# Altium project tclab_v1i1.PrjPcb (part 3 of 4)

## Sheet A4_esp32.SchDoc
size 368 x 228 mm; SheetNumber: 4; SheetTotal: 6
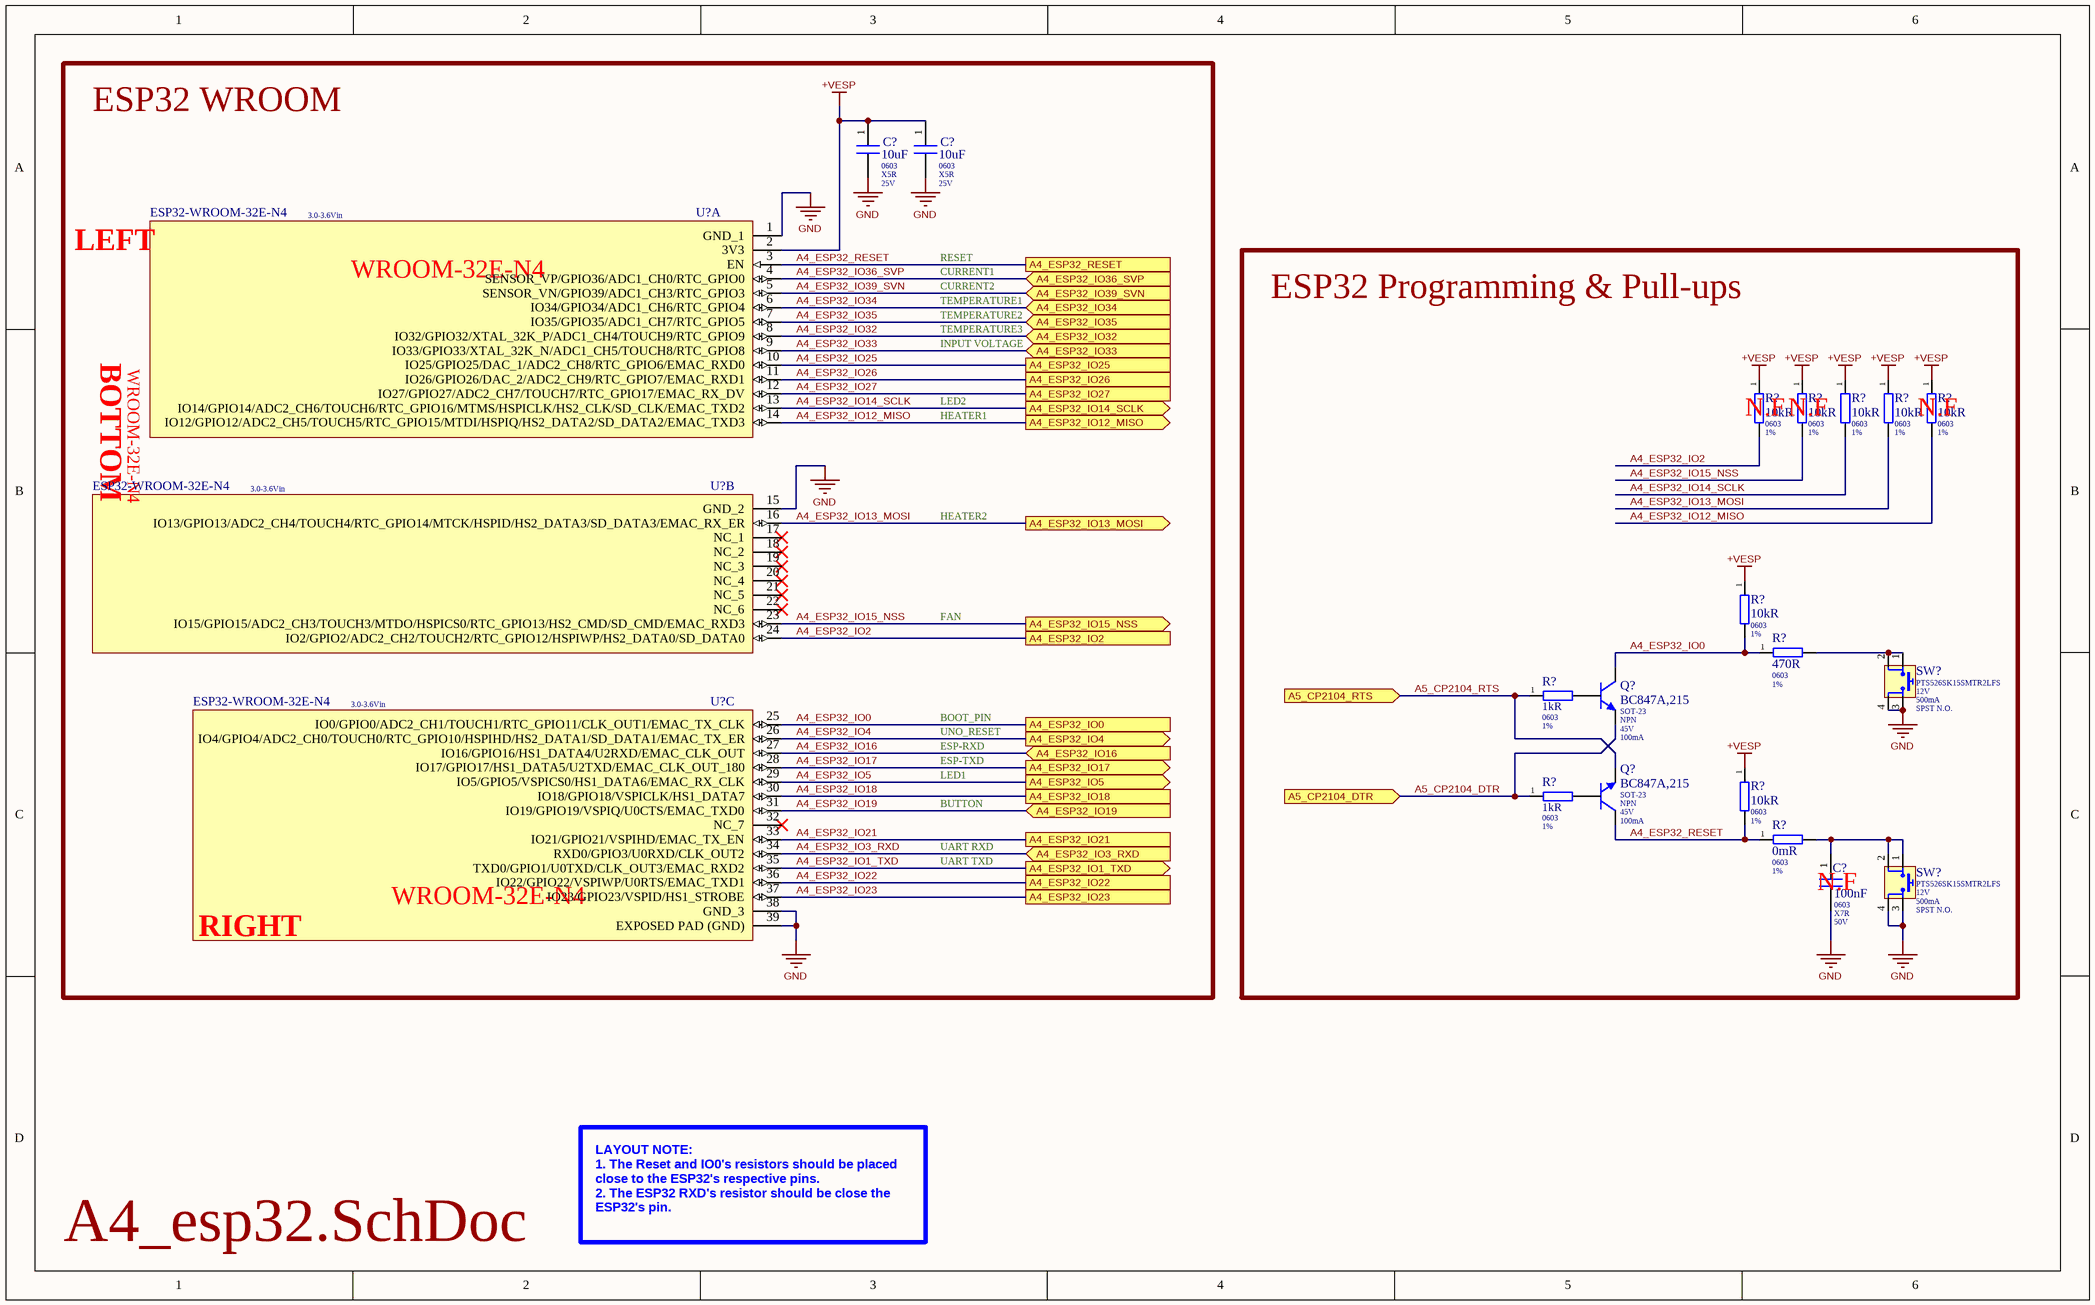
[diagram p3: A4_esp32.SchDoc]

### Parts
(Parts that share a designator on the sheet are numbered #1, #2 ... from top to bottom, then left to right.)
C?#13  Capacitance: 10uF  Case Code (Imperial): 0603  Dielectric: X5R  Voltage: 25V  [CAPC1608X10N]  (hidden comment: CAP-CER_10u_25V_20%_X5R_0603)
C?#14  Capacitance: 10uF  Case Code (Imperial): 0603  Dielectric: X5R  Voltage: 25V  [CAPC1608X10N]  (hidden comment: CAP-CER_10u_25V_20%_X5R_0603)
C?#15  Capacitance: 100nF  Case/Package: 0603  Dielectric: X7R  Voltage Rating (DC): 50V  [CAPC1608X09N]  (hidden comment: CAP-CER_100n_50V_20%_X7R_0603)
Q?#5  MFG PN: BC847A,215  Case/Package: SOT-23  Polarity: NPN  Voltage Rating (DC): 45V  Max Collector Current: 100mA  [SOT95P230X110-3N]  (hidden comment: TRNS-NPN_45V_100mA_SOT-23)
Q?#6  MFG PN: BC847A,215  Case/Package: SOT-23  Polarity: NPN  Voltage Rating (DC): 45V  Max Collector Current: 100mA  [SOT95P230X110-3N]  (hidden comment: TRNS-NPN_45V_100mA_SOT-23)
R?#33  Resistance: 10kR  Case/Package: 0603  Tolerance: 1%  [RESC1608X06N]  (hidden comment: RES_10K_100mW_1%_0603)
R?#34  Resistance: 10kR  Case/Package: 0603  Tolerance: 1%  [RESC1608X06N]  (hidden comment: RES_10K_100mW_1%_0603)
R?#35  Resistance: 10kR  Case/Package: 0603  Tolerance: 1%  [RESC1608X06N]  (hidden comment: RES_10K_100mW_1%_0603)
R?#36  Resistance: 10kR  Case/Package: 0603  Tolerance: 1%  [RESC1608X06N]  (hidden comment: RES_10K_100mW_1%_0603)
R?#37  Resistance: 10kR  Case/Package: 0603  Tolerance: 1%  [RESC1608X06N]  (hidden comment: RES_10K_100mW_1%_0603)
R?#38  Resistance: 10kR  Case/Package: 0603  Tolerance: 1%  [RESC1608X06N]  (hidden comment: RES_10K_100mW_1%_0603)
R?#39  value 470R  Case/Package: 0603  Tolerance: 1%  [RESC1608X06N]  (hidden comment: RES_470R_100mW_1%_0603)
R?#40  Resistance: 1kR  Case/Package: 0603  Tolerance: 1%  [RESC1608X06N]  (hidden comment: RES_1K_100mW_1%_0603)
R?#41  Resistance: 10kR  Case/Package: 0603  Tolerance: 1%  [RESC1608X06N]  (hidden comment: RES_10K_100mW_1%_0603)
R?#42  Resistance: 1kR  Case/Package: 0603  Tolerance: 1%  [RESC1608X06N]  (hidden comment: RES_1K_100mW_1%_0603)
R?#43  Resistance: 0mR  Case/Package: 0603  Tolerance: 1%  [RESC1608X06N]  (hidden comment: RES_0R_100mW_1%_0603)
SW?#2  MFG PN: PTS526SK15SMTR2LFS  _Maximum Voltage: 12V  _Maximum Current: 500mA  _Function: SPST N.O.  [CK_PTS526SK15SMTR2LFS]  (hidden comment: SW_Tactile_1_SPST-N.O._12_500m_SMD)
SW?#3  MFG PN: PTS526SK15SMTR2LFS  _Maximum Voltage: 12V  _Maximum Current: 500mA  _Function: SPST N.O.  [CK_PTS526SK15SMTR2LFS]  (hidden comment: SW_Tactile_1_SPST-N.O._12_500m_SMD)
U?#8  MFG PN: ESP32-WROOM-32E-N4  Supply Voltage: 3.0-3.6Vin  [XCVR_ESP32-WROOM-32E]  (hidden comment: MOD_XCVR_3-3.6Vin_18x25.5x3.1mm)  (part A of 3)
U?#9  MFG PN: ESP32-WROOM-32E-N4  Supply Voltage: 3.0-3.6Vin  [XCVR_ESP32-WROOM-32E]  (hidden comment: MOD_XCVR_3-3.6Vin_18x25.5x3.1mm)  (part B of 3)
U?#10  MFG PN: ESP32-WROOM-32E-N4  Supply Voltage: 3.0-3.6Vin  [XCVR_ESP32-WROOM-32E]  (hidden comment: MOD_XCVR_3-3.6Vin_18x25.5x3.1mm)  (part C of 3)

### Blocks framed on the sheet
ESP32 WROOM: C?#13 C?#14 U?#8-U?#10
ESP32 Programming & Pull-ups: C?#15 Q?#5 Q?#6 R?#33-R?#43 SW?#2 SW?#3

### Ports
A4_ESP32_IO0, A4_ESP32_IO1_TXD (out), A4_ESP32_IO2, A4_ESP32_IO3_RXD (in), A4_ESP32_IO4 (out), A4_ESP32_IO5 (out), A4_ESP32_IO12_MISO (out), A4_ESP32_IO13_MOSI (out), A4_ESP32_IO14_SCLK (out), A4_ESP32_IO15_NSS (out), A4_ESP32_IO16 (in), A4_ESP32_IO17 (out), A4_ESP32_IO18, A4_ESP32_IO19 (in), A4_ESP32_IO21, A4_ESP32_IO22, A4_ESP32_IO23, A4_ESP32_IO25, A4_ESP32_IO26, A4_ESP32_IO27, A4_ESP32_IO32 (in), A4_ESP32_IO33 (in), A4_ESP32_IO34 (in), A4_ESP32_IO35 (in), A4_ESP32_IO36_SVP (in), A4_ESP32_IO39_SVN (in), A4_ESP32_RESET, A5_CP2104_DTR (in), A5_CP2104_RTS (in)

### Nets
+VESP: C?#13.1 C?#14.1 R?#33.1 R?#34.1 R?#35.1 R?#36.1 R?#37.1 R?#38.1 R?#41.1 U?#8.2(3V3)
GND: C?#13.2 C?#14.2 C?#15.2 SW?#2.3 SW?#2.4 SW?#3.3 SW?#3.4 U?#8.1(GND_1) U?#9.15(GND_2) U?#10.38(GND_3) U?#10.39(EXPOSED_PAD_(GND))
A4_ESP32_IO0: Q?#5.3(C) R?#38.2 R?#39.1 U?#10.25(IO0/GPIO0/ADC2_CH1/TOUCH1/RTC_GPIO11/CLK_OUT1/EMAC_TX_CLK) ; port A4_ESP32_IO0
A4_ESP32_IO1_TXD: U?#10.35(TXD0/GPIO1/U0TXD/CLK_OUT3/EMAC_RXD2) ; port A4_ESP32_IO1_TXD
A4_ESP32_IO2: R?#33.2 U?#9.24(IO2/GPIO2/ADC2_CH2/TOUCH2/RTC_GPIO12/HSPIWP/HS2_DATA0/SD_DATA0) ; port A4_ESP32_IO2
A4_ESP32_IO3_RXD: U?#10.34(RXD0/GPIO3/U0RXD/CLK_OUT2) ; port A4_ESP32_IO3_RXD
A4_ESP32_IO4: U?#10.26(IO4/GPIO4/ADC2_CH0/TOUCH0/RTC_GPIO10/HSPIHD/HS2_DATA1/SD_DATA1/EMAC_TX_ER) ; port A4_ESP32_IO4
A4_ESP32_IO5: U?#10.29(IO5/GPIO5/VSPICS0/HS1_DATA6/EMAC_RX_CLK) ; port A4_ESP32_IO5
A4_ESP32_IO12_MISO: R?#37.2 U?#8.14(IO12/GPIO12/ADC2_CH5/TOUCH5/RTC_GPIO15/MTDI/HSPIQ/HS2_DATA2/SD_DATA2/EMAC_TXD3) ; port A4_ESP32_IO12_MISO
A4_ESP32_IO13_MOSI: R?#36.2 U?#9.16(IO13/GPIO13/ADC2_CH4/TOUCH4/RTC_GPIO14/MTCK/HSPID/HS2_DATA3/SD_DATA3/EMAC_RX_ER) ; port A4_ESP32_IO13_MOSI
A4_ESP32_IO14_SCLK: R?#35.2 U?#8.13(IO14/GPIO14/ADC2_CH6/TOUCH6/RTC_GPIO16/MTMS/HSPICLK/HS2_CLK/SD_CLK/EMAC_TXD2) ; port A4_ESP32_IO14_SCLK
A4_ESP32_IO15_NSS: R?#34.2 U?#9.23(IO15/GPIO15/ADC2_CH3/TOUCH3/MTDO/HSPICS0/RTC_GPIO13/HS2_CMD/SD_CMD/EMAC_RXD3) ; port A4_ESP32_IO15_NSS
A4_ESP32_IO16: U?#10.27(IO16/GPIO16/HS1_DATA4/U2RXD/EMAC_CLK_OUT) ; port A4_ESP32_IO16
A4_ESP32_IO17: U?#10.28(IO17/GPIO17/HS1_DATA5/U2TXD/EMAC_CLK_OUT_180) ; port A4_ESP32_IO17
A4_ESP32_IO18: U?#10.30(IO18/GPIO18/VSPICLK/HS1_DATA7) ; port A4_ESP32_IO18
A4_ESP32_IO19: U?#10.31(IO19/GPIO19/VSPIQ/U0CTS/EMAC_TXD0) ; port A4_ESP32_IO19
A4_ESP32_IO21: U?#10.33(IO21/GPIO21/VSPIHD/EMAC_TX_EN) ; port A4_ESP32_IO21
A4_ESP32_IO22: U?#10.36(IO22/GPIO22/VSPIWP/U0RTS/EMAC_TXD1) ; port A4_ESP32_IO22
A4_ESP32_IO23: U?#10.37(IO23/GPIO23/VSPID/HS1_STROBE) ; port A4_ESP32_IO23
A4_ESP32_IO25: U?#8.10(IO25/GPIO25/DAC_1/ADC2_CH8/RTC_GPIO6/EMAC_RXD0) ; port A4_ESP32_IO25
A4_ESP32_IO26: U?#8.11(IO26/GPIO26/DAC_2/ADC2_CH9/RTC_GPIO7/EMAC_RXD1) ; port A4_ESP32_IO26
A4_ESP32_IO27: U?#8.12(IO27/GPIO27/ADC2_CH7/TOUCH7/RTC_GPIO17/EMAC_RX_DV) ; port A4_ESP32_IO27
A4_ESP32_IO32: U?#8.8(IO32/GPIO32/XTAL_32K_P/ADC1_CH4/TOUCH9/RTC_GPIO9) ; port A4_ESP32_IO32
A4_ESP32_IO33: U?#8.9(IO33/GPIO33/XTAL_32K_N/ADC1_CH5/TOUCH8/RTC_GPIO8) ; port A4_ESP32_IO33
A4_ESP32_IO34: U?#8.6(IO34/GPIO34/ADC1_CH6/RTC_GPIO4) ; port A4_ESP32_IO34
A4_ESP32_IO35: U?#8.7(IO35/GPIO35/ADC1_CH7/RTC_GPIO5) ; port A4_ESP32_IO35
A4_ESP32_IO36_SVP: U?#8.4(SENSOR_VP/GPIO36/ADC1_CH0/RTC_GPIO0) ; port A4_ESP32_IO36_SVP
A4_ESP32_IO39_SVN: U?#8.5(SENSOR_VN/GPIO39/ADC1_CH3/RTC_GPIO3) ; port A4_ESP32_IO39_SVN
A4_ESP32_RESET: Q?#6.3(C) R?#41.2 R?#43.1 U?#8.3(EN) ; port A4_ESP32_RESET
A5_CP2104_DTR: Q?#5.2(E) R?#42.1 ; port A5_CP2104_DTR
A5_CP2104_RTS: Q?#6.2(E) R?#40.1 ; port A5_CP2104_RTS
NetC?#15_1: C?#15.1 R?#43.2 SW?#3.1 SW?#3.2
NetQ?#5_1: Q?#5.1(B) R?#40.2
NetQ?#6_1: Q?#6.1(B) R?#42.2
NetR?#39_2: R?#39.2 SW?#2.1 SW?#2.2

Not connected (* = marked no-connect by the designer): U?#9 17(NC_1)* 18(NC_2)* 19(NC_3)* 20(NC_4)* 21(NC_5)* 22(NC_6)*; U?#10 32(NC_7)*

### Notes on the sheet
- RESET
- TEMPERATURE1
- TEMPERATURE2
- CURRENT1
- CURRENT2
- INPUT VOLTAGE
- TEMPERATURE3
- LED2
- HEATER1
- (near R?#33) N.F
- (near R?#34) N.F
- (near R?#37) N.F
- HEATER2
- FAN
- BOOT_PIN
- UNO_RESET
- ESP-RXD
- ESP-TXD
- LED1
- BUTTON
- UART RXD
- UART TXD
- (near C?#15) N.F
- LAYOUT NOTE:
  1. The Reset and IO0's resistors should be placed close to the ESP32's respective pins.
  2. The ESP32 RXD's resistor should be close the ESP32's pin.
- (in symbol Espressif_ESP32-WROOM-32E-N4, part A) LEFT; WROOM-32E-N4
- (in symbol Espressif_ESP32-WROOM-32E-N4, part B) BOTTOM; WROOM-32E-N4
- (in symbol Espressif_ESP32-WROOM-32E-N4, part C) RIGHT; WROOM-32E-N4

### Library data of the parts
C?#13 C?#14 = Samsung_CL10A106MA8NRNC: Material: 4241ConductorMaterial; Value: 10uF; Tolerance: 20%; _Checked_PCB: N.A; _Checked_SCH: HoP; Supplier: Mouser; Supplier Part Number: 187-CL10A106MA8NRNC; MFG: Samsung; MFG PN: CL10A106MA8NRNC; RoHS: Yes; Category: Ceramic Capacitors; Stock: 259799; Pricing: 1=0.14, 10=0.086, 50=0.086, 100=0.058, 1000=0.046, 10000=0.037 (USD); Mounting Technology: Surface Mount; Case/Package: 0603; Case Code (Metric): 1608; Min Operating Temperature: -55°C; Max Operating Temperature: 85°C; Packaging: Cut Tape; Voltage Rating: 25V; Series: CL; Height: 900um; RoHS Compliant: Yes; Lead Free: 5697LeadFree; ComponentLink1URL: https://datasheet.ciiva.com/25766/cl10a106ma8nrnc-25766562.pdf?src-supplier=Digikey; ComponentLink1Description: https://datasheet.ciiva.com/25766/cl10a106ma8nrnc-25766562.pdf?src-supplier=Digikey; _Creator: HoP; _SYM_REF: CAP-CER_10u_25V_20%_X5R_0603
C?#15 = Kemet_C0603C104M5RAC: MFG: KEMET; Dielectric Material: Ceramic; Tolerance: 20%; _Checked_PCB: HoP; Supplier 1: Mouser; MFG PN: C0603C104M5RAC; RoHS: Yes; Category: Ceramic Capacitors; Stock 1: 461921; Pricing 1: 1=0.1, 10=0.033, 50=0.033, 100=0.015, 1000=0.009, 10000=0.006 (USD); Mount: Surface Mount; Case Code (Imperial): 0603; Case Code (Metric): 1608; Min Operating Temperature: -55°C; Max Operating Temperature: 125°C; Packaging: Tape and Reel; Package Quantity: 4000; Termination: SMD/SMT; Series: C0603C; Construction: Flat; Length: 1.6mm; Width: 0.8mm; RoHS Compliant: Yes; ComponentLink1URL: http://www.mouser.com/ds/2/212/KEM_C1002_X7R_SMD-1102033.pdf?src-supplier=Mouser; ComponentLink1Description: http://www.mouser.com/ds/2/212/KEM_C1002_X7R_SMD-1102033.pdf?src-supplier=Mouser; Supplier Part Number 1: 80-C0603C104M5RAC; _Checked_SCH: HoP; _Creator: HoP; _SYM_REF: CAP-CER_100n_50V_20%_X7R_0603
Q?#5 Q?#6 = Nexperia_BC847A,215: _Checked_PCB: N.A; _Checked_SCH: HoP; Supplier: Digikey; Supplier Part Number: 1727-4240-1-ND; MFG: Nexperia; RoHS: Yes; Category: BJTs; Stock: 11953; Pricing: 1=0.1, 10=0.062, 100=0.0377, 500=0.02708, 1000=0.02362 (USD); Pins: 3NUMBER; RoHS Compliant: 5897YesNo; ComponentLink1URL: http://www.farnell.com/datasheets/1856333.pdf?src-supplier=Farnell; ComponentLink1Description: http://www.farnell.com/datasheets/1856333.pdf?src-supplier=Farnell; ComponentLink2URL: https://assets.nexperia.com/documents/data-sheet/BC847_SER.pdf?src-supplier=Digikey; ComponentLink2Description: https://assets.nexperia.com/documents/data-sheet/BC847_SER.pdf?src-supplier=Digikey; ComponentLink3URL: https://datasheet.octopart.com/BC847A%2C215-Nexperia-datasheet-164345412.pdf?src-supplier=Future+Electronics; ComponentLink3Description: https://datasheet.octopart.com/BC847A%2C215-Nexperia-datasheet-164345412.pdf?src-supplier=Future+Electronics; ComponentLink4URL: https://datasheet.octopart.com/BC847A%2C215-Nexperia-datasheet-11982477.pdf?src-supplier=Newark; ComponentLink4Description: https://datasheet.octopart.com/BC847A%2C215-Nexperia-datasheet-11982477.pdf?src-supplier=Newark; ComponentLink5URL: http://www.farnell.com/datasheets/1856333.pdf?src-supplier=Newark; ComponentLink5Description: http://www.farnell.com/datasheets/1856333.pdf?src-supplier=Newark; ComponentLink6URL: https://datasheet.octopart.com/BC847A%2C215-Nexperia-datasheet-160638900.pdf?src-supplier=Farnell; ComponentLink6Description: https://datasheet.octopart.com/BC847A%2C215-Nexperia-datasheet-160638900.pdf?src-supplier=Farnell; ComponentLink7URL: https://datasheet.octopart.com/BC847A%2C215-Nexperia-datasheet-160638900.pdf?src-supplier=Element14; ComponentLink7Description: https://datasheet.octopart.com/BC847A%2C215-Nexperia-datasheet-160638900.pdf?src-supplier=Element14; ComponentLink8URL: https://datasheet.octopart.com/BC847A%2C215-Nexperia-datasheet-5341283.pdf?src-supplier=TME; ComponentLink8Description: https://datasheet.octopart.com/BC847A%2C215-Nexperia-datasheet-5341283.pdf?src-supplier=TME; _Creator: HoP; _SYM_REF: TRNS-NPN_45V_100mA_SOT-23
R?#33-R?#38 R?#41 = Yageo_RC0603FR-0710KL: MFG: Yageo; Temperature Coefficient: 100ppm/°C; Voltage Rating (DC): 50V; Power Rating: 100mW; Voltage Rating: 75V; _Checked_PCB: HoP; _Checked_SCH: HoP_V1-1; _Value: 10000; Supplier 1: Mouser; MFG PN: RC0603FR-0710KL; RoHS: Yes; Category: Chip SMD Resistors; Stock 1: 13284125; Pricing 1: 1=0.1, 10=0.016, 50=0.016, 100=0.008, 1000=0.005, 10000=0.003 (USD); Number of Pins: 2; Case Code (Imperial): 0603; Case Code (Metric): 1608; Weight: 7.1E-05oz; Size Code: 0603; Min Operating Temperature: -55°C; Max Operating Temperature: 155°C; Resistor Type: Thick Film; Packaging: Tape and Reel; Termination: SMD/SMT; Features: Moisture Resistant; Series: RC; Max Power Dissipation: 100mW; Number of Terminations: 2; Resistance Tolerance: 1%; Construction: Rectangular; Length: 1.6mm; Width: 0.8mm; Height: 0.45mm; Depth: 0.8mm; Lead Pitch: 0.3mm; Reach SVHC Compliant: No; Lead Free: Lead Free; Military Standard: Not; RoHS Compliant: Yes; ComponentLink1URL: https://datasheet.ciiva.com/7660/38590-7660789.pdf?src-supplier=Element14; ComponentLink1Description: https://datasheet.ciiva.com/7660/38590-7660789.pdf?src-supplier=Element14; ComponentLink2URL: https://datasheet.ciiva.com/7983/443971-7983596.pdf?src-supplier=Element14; ComponentLink2Description: https://datasheet.ciiva.com/7983/443971-7983596.pdf?src-supplier=Element14; ComponentLink3URL: https://datasheet.ciiva.com/22747/443971-22747519.pdf?src-supplier=Element14; ComponentLink3Description: https://datasheet.ciiva.com/22747/443971-22747519.pdf?src-supplier=Element14; ComponentLink4URL: https://datasheet.ciiva.com/46440/1868787-46440891.pdf?src-supplier=Element14; ComponentLink4Description: https://datasheet.ciiva.com/46440/1868787-46440891.pdf?src-supplier=Element14; ComponentLink5URL: https://datasheet.ciiva.com/7746/1738695-7746239.pdf?src-supplier=Element14; ComponentLink5Description: https://datasheet.ciiva.com/7746/1738695-7746239.pdf?src-supplier=Element14; ComponentLink6URL: https://datasheet.ciiva.com/15189/getdatasheetpartid-409289-15189591.pdf?src-supplier=Verical; ComponentLink6Description: https://datasheet.ciiva.com/15189/getdatasheetpartid-409289-15189591.pdf?src-supplier=Verical; Supplier Part Number 1: 603-RC0603FR-0710KL; _Creator: HoP; _SYM_REF: RES_10K_100mW_1%_0603
R?#39 = Yageo_RC0603FR-07470RL: MFG: Yageo; Power Rating: 100mW; Voltage Rating: 50V; Temperature Coefficient: 100ppm/°C; Working Voltage: 75V; Impedance: 50R; _Checked_PCB: N.A; _Checked_SCH: HoP; _Value: 470; Supplier: Mouser; Supplier Part Number: 603-RC0603FR-07470RL; MFG PN: RC0603FR-07470RL; RoHS: Yes; Category: Chip SMD Resistors; Stock: 209227; Pricing: 1=0.1, 10=0.008, 50=0.008, 100=0.007, 1000=0.006, 10000=0.002 (USD); Case Code (Metric): 1608; Case Code (Imperial): 0603; Contact Material: 152ConductorMaterial; Contact Plating: 157ConductorMaterial; Min Operating Temperature: -55°C; Max Operating Temperature: 155°C; Packaging: Tape and Reel; Number of Terminations: 2; Termination: SMD/SMT; Max Power Dissipation: 100mW; Features: Moisture Resistant; Package Quantity: 1; Resistor Type: Thick Film; Series: RC; Technology: THICK FILM; Length: 0.063inch; Width: 0.031inch; Height: 0.022inch; Depth: 0.8mm; Radiation Hardening: 5898YesNo; Reach SVHC Compliant: No; Lead Free: Lead Free; RoHS Compliant: Yes; ComponentLink1URL: https://datasheet.ciiva.com/11808/0900766b80f96399-11808177.pdf?src-supplier=Rs; ComponentLink1Description: https://datasheet.ciiva.com/11808/0900766b80f96399-11808177.pdf?src-supplier=Rs; ComponentLink2URL: https://datasheet.ciiva.com/7660/1868787-7660793.pdf?src-supplier=Element14; ComponentLink2Description: https://datasheet.ciiva.com/7660/1868787-7660793.pdf?src-supplier=Element14; ComponentLink3URL: https://datasheet.ciiva.com/46440/1868787-46440907.pdf?src-supplier=Element14; ComponentLink3Description: https://datasheet.ciiva.com/46440/1868787-46440907.pdf?src-supplier=Element14; ComponentLink4URL: https://datasheet.ciiva.com/2454/pyu-r-int-thick-7-2454013.pdf?src-supplier=Digikey; ComponentLink4Description: https://datasheet.ciiva.com/2454/pyu-r-int-thick-7-2454013.pdf?src-supplier=Digikey; ComponentLink5URL: https://datasheet.ciiva.com/2454/pyu-r-int-thick-7-2454014.pdf?src-supplier=Digikey; ComponentLink5Description: https://datasheet.ciiva.com/2454/pyu-r-int-thick-7-2454014.pdf?src-supplier=Digikey; ComponentLink6URL: https://datasheet.ciiva.com/2454/pyu-r-int-thick-7-2454012.pdf?src-supplier=Digikey; ComponentLink6Description: https://datasheet.ciiva.com/2454/pyu-r-int-thick-7-2454012.pdf?src-supplier=Digikey; ComponentLink7URL: https://datasheet.ciiva.com/7746/1738695-7746360.pdf?src-supplier=Element14; ComponentLink7Description: https://datasheet.ciiva.com/7746/1738695-7746360.pdf?src-supplier=Element14; ComponentLink8URL: https://datasheet.ciiva.com/7746/1738695-7746359.pdf?src-supplier=Element14; ComponentLink8Description: https://datasheet.ciiva.com/7746/1738695-7746359.pdf?src-supplier=Element14; _Creator: HoP; _SYM_REF: RES_470R_100mW_1%_0603; Resistance Tolerance: 1%
R?#40 R?#42 = Yageo_RC0603FR-071KL: MFG: Yageo; Temperature Coefficient: 100ppm/°C; Power Rating: 100mW; Voltage Rating: 50V; _Checked_PCB: HoP; _Value: 1000; Supplier 1: Mouser; MFG PN: RC0603FR-071KL; RoHS: Yes; Category: Chip SMD Resistors; Stock 1: 9806849; Pricing 1: 1=0.1, 10=0.019, 50=0.019, 100=0.007, 1000=0.004, 10000=0.002 (USD); Contact Plating: Tin,Matte; Case Code (Imperial): 0603; Case Code (Metric): 1608; Size Code: 0603; Min Operating Temperature: -55°C; Max Operating Temperature: 155°C; Resistor Type: Thick Film; Packaging: Tape and Reel; Termination: SMD/SMT; Features: Moisture Resistant; Series: RC; Max Power Dissipation: 100mW; Number of Terminations: 2; Technology: THICK FILM; Resistance Tolerance: 1%; Construction: Rectangular; Length: 1.6mm; Height: 0.45mm; Depth: 0.8mm; Reach SVHC Compliant: No; Lead Free: Lead Free; Military Standard: Not; RoHS Compliant: Yes; Supplier Part Number 1: 603-RC0603FR-071KL; _Checked_SCH: HoP; _Creator: HoP; _SYM_REF: RES_1K_100mW_1%_0603
R?#43 = Yageo_RC0603FR-070RL: MFG: Yageo; Power Rating: 100mW; Voltage Rating (DC): 50V; Temperature Coefficient: 200ppm/°C; _Checked_PCB: HoP; _Value: 0; Supplier 1: Mouser; MFG PN: RC0603FR-070RL; RoHS: Yes; Category: Chip SMD Resistors; Stock 1: 3348927; Pricing 1: 1=0.1, 10=0.01, 50=0.01, 100=0.005, 1000=0.004, 10000=0.003 (USD); Number of Pins: 2; Contact Plating: Tin,Matte; Case Code (Metric): 1608; Case Code (Imperial): 0603; Min Operating Temperature: -55°C; Max Operating Temperature: 155°C; Packaging: Tape and Reel; Resistor Type: Thick Film; Package Quantity: 5000; Voltage Rating: 50V; Number of Terminations: 2; Termination: SMD/SMT; Max Power Dissipation: 100mW; Features: Moisture Resistant; Series: RC; Construction: Rectangular; Resistance Tolerance: 1%; Technology: THICK FILM; Length: 1.6mm; Width: 0.8mm; Height: 0.45mm; Depth: 0.8mm; Reach SVHC Compliant: No; Lead Free: Lead Free; RoHS Compliant: Yes; Military Standard: Not; ComponentLink1URL: https://datasheet.ciiva.com/11808/0900766b80f96399-11808172.pdf?src-supplier=Rs; ComponentLink1Description: https://datasheet.ciiva.com/11808/0900766b80f96399-11808172.pdf?src-supplier=Rs; ComponentLink2URL: https://datasheet.ciiva.com/5684/443971-5684699.pdf?src-supplier=Farnell; ComponentLink2Description: https://datasheet.ciiva.com/5684/443971-5684699.pdf?src-supplier=Farnell; ComponentLink3URL: https://datasheet.ciiva.com/7983/443971-7983627.pdf?src-supplier=Element14; ComponentLink3Description: https://datasheet.ciiva.com/7983/443971-7983627.pdf?src-supplier=Element14; ComponentLink4URL: https://datasheet.ciiva.com/22643/1868787-22643388.pdf?src-supplier=Element14; ComponentLink4Description: https://datasheet.ciiva.com/22643/1868787-22643388.pdf?src-supplier=Element14; ComponentLink5URL: https://datasheet.ciiva.com/46382/443971-46382072.pdf?src-supplier=Element14; ComponentLink5Description: https://datasheet.ciiva.com/46382/443971-46382072.pdf?src-supplier=Element14; ComponentLink6URL: https://datasheet.ciiva.com/29721/pyu-r-int-thick-7-29721178.pdf?src-supplier=Digi-Key; ComponentLink6Description: https://datasheet.ciiva.com/29721/pyu-r-int-thick-7-29721178.pdf?src-supplier=Digi-Key; ComponentLink7URL: https://datasheet.ciiva.com/29721/pyu-rc0603-51-rohs-l-4-29721179.pdf?src-supplier=Digi-Key; ComponentLink7Description: https://datasheet.ciiva.com/29721/pyu-rc0603-51-rohs-l-4-29721179.pdf?src-supplier=Digi-Key; ComponentLink8URL: https://datasheet.ciiva.com/5558/rc0603-272842-5558341.pdf?src-supplier=Mouser; ComponentLink8Description: https://datasheet.ciiva.com/5558/rc0603-272842-5558341.pdf?src-supplier=Mouser; Supplier Part Number 1: 603-RC0603FR-070RL; _Checked_SCH: HoP; _Creator: HoP; _SYM_REF: RES_0R_100mW_1%_0603
SW?#2 SW?#3 = CK_PTS526SK15SMTR2LFS: MFG: ITT C&K; _Checked_PCB: HoP; Supplier 1: Mouser; RoHS: No; Category: Uncategorized; Stock 1: 68360; Pricing 1: 1=0.13, 10=0.128, 50=0.128, 100=0.11, 1000=0.079, 10000=0.067 (USD); Supplier Part Number 1: 611-PTS526SK15SMR2L; _Checked_SCH: HoP; _Creator: HoP; _SYM_REF: SW_Tactile_1_SPST-N.O._12_500m_SMD
U?#8-U?#10 = Espressif_ESP32-WROOM-32E-N4: MFG: Espressif Systems; _Checked_PCB: N.A; _Creator: HoP; Supplier: Digikey; Supplier Part Number: 1965-ESP32-WROOM-32E-N4CT-ND; RoHS: No; Category: LDO; Stock: 12881; Pricing: 1=4.84, 10=4.189, 25=3.9612, 100=3.649, 250=3.46184 (USD); ComponentLink1URL: https://datasheet.octopart.com/ESP32-WROOM-32E-N4-Espressif-Systems-datasheet-151884363.pdf?src-supplier=Future+Electronics; ComponentLink1Description: https://datasheet.octopart.com/ESP32-WROOM-32E-N4-Espressif-Systems-datasheet-151884363.pdf?src-supplier=Future+Electronics; ComponentLink2URL: https://datasheet.octopart.com/ESP32-WROOM-32E-N4-Espressif-Systems-datasheet-188867343.pdf?src-supplier=TME; ComponentLink2Description: https://datasheet.octopart.com/ESP32-WROOM-32E-N4-Espressif-Systems-datasheet-188867343.pdf?src-supplier=TME; _Checked_SCH: N.A; _SYM_REF: MOD_XCVR_3-3.6Vin_18x25.5x3.1mm

## Sheet A5_sub_interface.SchDoc
size A4; SheetNumber: 5; SheetTotal: 6
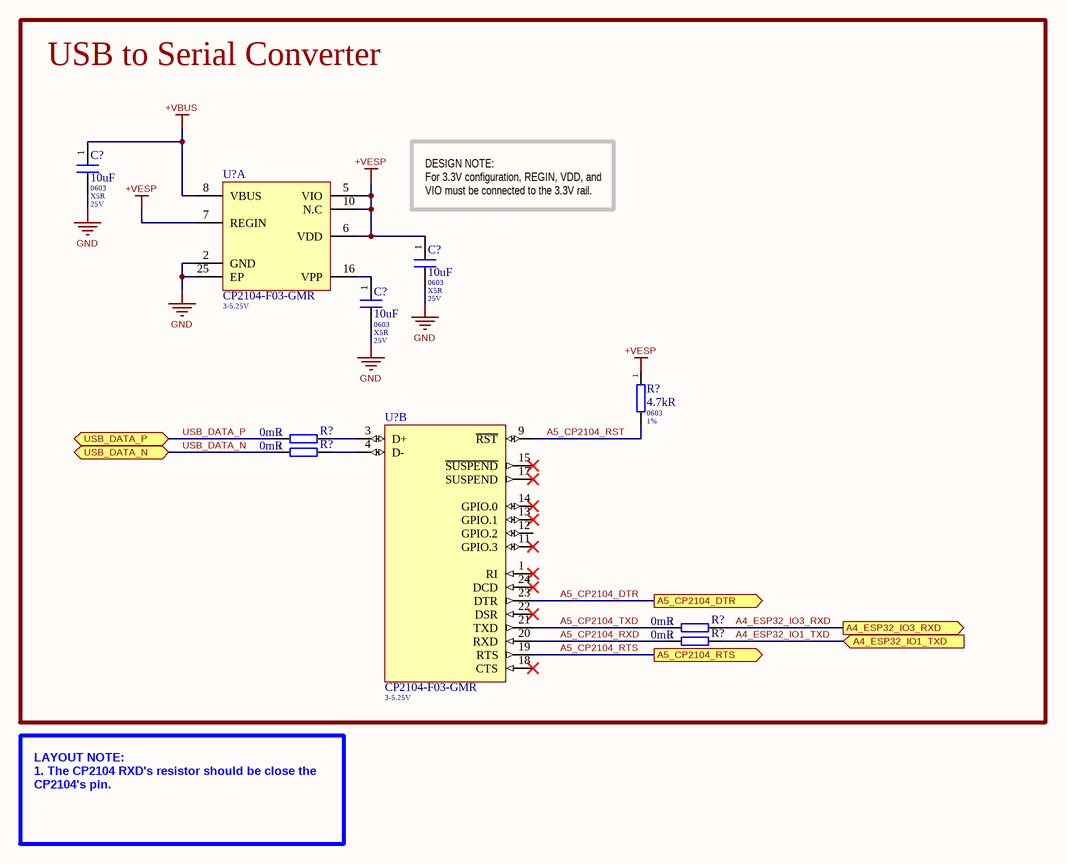
[diagram p4: A5_sub_interface.SchDoc]

### Parts
(Parts that share a designator on the sheet are numbered #1, #2 ... from top to bottom, then left to right.)
C?#16  Capacitance: 10uF  Case Code (Imperial): 0603  Dielectric: X5R  Voltage: 25V  [CAPC1608X10N]  (hidden comment: CAP-CER_10u_25V_20%_X5R_0603)
C?#17  Capacitance: 10uF  Case Code (Imperial): 0603  Dielectric: X5R  Voltage: 25V  [CAPC1608X10N]  (hidden comment: CAP-CER_10u_25V_20%_X5R_0603)
C?#18  Capacitance: 10uF  Case Code (Imperial): 0603  Dielectric: X5R  Voltage: 25V  [CAPC1608X10N]  (hidden comment: CAP-CER_10u_25V_20%_X5R_0603)
R?#44  value 4.7kR  Case/Package: 0603  Tolerance: 1%  [RESC1608X06N]  (hidden comment: RES_4.7K_100mW_1%_0603)
R?#45  Resistance: 0mR  [RESC1608X06N]  (hidden comment: RES_0R_100mW_1%_0603)
R?#46  Resistance: 0mR  [RESC1608X06N]  (hidden comment: RES_0R_100mW_1%_0603)
R?#47  Resistance: 0mR  [RESC1608X06N]  (hidden comment: RES_0R_100mW_1%_0603)
R?#48  Resistance: 0mR  [RESC1608X06N]  (hidden comment: RES_0R_100mW_1%_0603)
U?#11  MFG PN: CP2104-F03-GMR  Voltage Range: 3-5.25V  [QFN50P400X400X80_HS-25N]  (hidden comment: IC_USB-SERIAL_CP2104-F03-GMR_3-5.25Vin_2Mbit_QFN-24)  (part A of 2)
U?#12  MFG PN: CP2104-F03-GMR  Voltage Range: 3-5.25V  [QFN50P400X400X80_HS-25N]  (hidden comment: IC_USB-SERIAL_CP2104-F03-GMR_3-5.25Vin_2Mbit_QFN-24)  (part B of 2)

### Blocks framed on the sheet
USB to Serial Converter: C?#16-C?#18 R?#44-R?#48 U?#11 U?#12

### Ports
A4_ESP32_IO1_TXD (in), A4_ESP32_IO3_RXD (out), A5_CP2104_DTR (out), A5_CP2104_RTS (out), USB_DATA_N (bidir), USB_DATA_P (bidir)

### Nets
+VBUS: C?#16.1 U?#11.8(VBUS)
+VESP: C?#17.1 R?#44.1 U?#11.5(VIO) U?#11.6(VDD) U?#11.7(REGIN) U?#11.10(N.C)
GND: C?#16.2 C?#17.2 C?#18.2 U?#11.2(GND) U?#11.25(EP)
A4_ESP32_IO1_TXD: R?#48.2 ; port A4_ESP32_IO1_TXD
A4_ESP32_IO3_RXD: R?#47.2 ; port A4_ESP32_IO3_RXD
A5_CP2104_DTR: U?#12.23(DTR) ; port A5_CP2104_DTR
A5_CP2104_RST: R?#44.2 U?#12.9(~{RST})
A5_CP2104_RTS: U?#12.19(RTS) ; port A5_CP2104_RTS
A5_CP2104_RXD: R?#48.1 U?#12.20(RXD)
A5_CP2104_TXD: R?#47.1 U?#12.21(TXD)
USB_DATA_N: R?#46.1 ; port USB_DATA_N  [project net A1_USB_DATA_N]
USB_DATA_P: R?#45.1 ; port USB_DATA_P  [project net A1_USB_DATA_P]
NetC?#18_1: C?#18.1 U?#11.16(VPP)
NetR?#45_2: R?#45.2 U?#12.3(D+)
NetR?#46_2: R?#46.2 U?#12.4(D-)

Not connected (* = marked no-connect by the designer): U?#12 1(RI)* 11(GPIO.3)* 12(GPIO.2) 13(GPIO.1)* 14(GPIO.0)* 15(~{SUSPEND})* 17(SUSPEND)* 18(CTS)* 22(DSR)* 24(DCD)*

### Notes on the sheet
- DESIGN NOTE:
  For 3.3V configuration, REGIN, VDD, and VIO must be connected to the 3.3V rail.
- LAYOUT NOTE:
  1. The CP2104 RXD's resistor should be close the CP2104's pin.

### Library data of the parts
C?#16-C?#18 = Samsung_CL10A106MA8NRNC: as C?#13 on sheet A4_esp32; Supplier: Mouser; Supplier Part Number: 187-CL10A106MA8NRNC; MFG: Samsung; MFG PN: CL10A106MA8NRNC; RoHS: Yes; Category: Ceramic Capacitors; Stock: 259799; Pricing: 1=0.14, 10=0.086, 50=0.086, 100=0.058, 1000=0.046, 10000=0.037 (USD); Mounting Technology: Surface Mount; Case/Package: 0603; Case Code (Metric): 1608; Min Operating Temperature: -55°C; Max Operating Temperature: 85°C; Packaging: Cut Tape; Voltage Rating: 25V; Series: CL; Height: 900um; RoHS Compliant: Yes; Lead Free: 5697LeadFree; ComponentLink1URL: https://datasheet.ciiva.com/25766/cl10a106ma8nrnc-25766562.pdf?src-supplier=Digikey; ComponentLink1Description: https://datasheet.ciiva.com/25766/cl10a106ma8nrnc-25766562.pdf?src-supplier=Digikey; _Creator: HoP; _SYM_REF: CAP-CER_10u_25V_20%_X5R_0603
R?#44 = Yageo_RC0603FR-074K7L: MFG: Yageo; Power Rating: 100mW; Voltage Rating (DC): 50V; Temperature Coefficient: 100ppm/°C; _Checked_PCB: N.A; _Checked_SCH: HoP; _Value: 4700; Supplier: Digikey; Supplier Part Number: 311-4.70KHRCT-ND; MFG PN: RC0603FR-074K7L; RoHS: Yes; Category: Chip SMD Resistors; Stock: 1531710; Pricing: 1=0.1, 10=0.009, 100=0.0082, 1000=0.0051 (USD); Pins: 2; Case Code (Imperial): 0603; Case Code (Metric): 1608; Min Operating Temperature: -55°C; Max Operating Temperature: 155°C; Resistor Type: Thick Film; Packaging: Tape and Reel; Voltage Rating: 50V; Termination: SMD/SMT; Features: Moisture Resistant; Series: RC; Max Power Dissipation: 100mW; Number of Terminations: 2; Construction: Rectangular; Resistance Tolerance: 1%; Length: 1.6mm; Width: 0.8mm; Depth: 0.8mm; Lead Pitch: 0.3mm; Reach SVHC Compliant: Unknown; Lead Free: 5697LeadFree; Military Standard: Not; RoHS Compliant: Yes; ComponentLink1URL: https://datasheet.ciiva.com/15189/getdatasheetpartid-422754-15189760.pdf?src-supplier=Verical; ComponentLink1Description: https://datasheet.ciiva.com/15189/getdatasheetpartid-422754-15189760.pdf?src-supplier=Verical; ComponentLink2URL: https://datasheet.ciiva.com/46440/1868787-46440909.pdf?src-supplier=Element14; ComponentLink2Description: https://datasheet.ciiva.com/46440/1868787-46440909.pdf?src-supplier=Element14; ComponentLink3URL: https://datasheet.ciiva.com/7660/38590-7660794.pdf?src-supplier=Element14; ComponentLink3Description: https://datasheet.ciiva.com/7660/38590-7660794.pdf?src-supplier=Element14; ComponentLink4URL: https://datasheet.ciiva.com/22747/443971-22747528.pdf?src-supplier=Element14; ComponentLink4Description: https://datasheet.ciiva.com/22747/443971-22747528.pdf?src-supplier=Element14; ComponentLink5URL: https://datasheet.ciiva.com/7746/1868787-7746365.pdf?src-supplier=Element14; ComponentLink5Description: https://datasheet.ciiva.com/7746/1868787-7746365.pdf?src-supplier=Element14; ComponentLink6URL: https://datasheet.ciiva.com/7746/1738695-7746366.pdf?src-supplier=Element14; ComponentLink6Description: https://datasheet.ciiva.com/7746/1738695-7746366.pdf?src-supplier=Element14; _Creator: HoP; _SYM_REF: RES_4.7K_100mW_1%_0603
R?#45-R?#48 = Yageo_RC0603FR-070RL: MFG: Yageo; Power Rating: 100mW; Voltage Rating (DC): 50V; Temperature Coefficient: 200ppm/°C; Resistance Tolerance: 1%; _Checked_PCB: HoP; _Value: 0; Supplier 1: Mouser; MFG PN: RC0603FR-070RL; RoHS: Yes; Category: Chip SMD Resistors; Stock 1: 3348927; Pricing 1: 1=0.1, 10=0.01, 50=0.01, 100=0.005, 1000=0.004, 10000=0.003 (USD); Number of Pins: 2; Contact Plating: Tin,Matte; Case Code (Metric): 1608; Case Code (Imperial): 0603; Min Operating Temperature: -55°C; Max Operating Temperature: 155°C; Packaging: Tape and Reel; Resistor Type: Thick Film; Package Quantity: 5000; Voltage Rating: 50V; Number of Terminations: 2; Termination: SMD/SMT; Max Power Dissipation: 100mW; Features: Moisture Resistant; Series: RC; Construction: Rectangular; Technology: THICK FILM; Length: 1.6mm; Width: 0.8mm; Height: 0.45mm; Depth: 0.8mm; Reach SVHC Compliant: No; Lead Free: Lead Free; RoHS Compliant: Yes; Military Standard: Not; ComponentLink1URL: https://datasheet.ciiva.com/11808/0900766b80f96399-11808172.pdf?src-supplier=Rs; ComponentLink1Description: https://datasheet.ciiva.com/11808/0900766b80f96399-11808172.pdf?src-supplier=Rs; ComponentLink2URL: https://datasheet.ciiva.com/5684/443971-5684699.pdf?src-supplier=Farnell; ComponentLink2Description: https://datasheet.ciiva.com/5684/443971-5684699.pdf?src-supplier=Farnell; ComponentLink3URL: https://datasheet.ciiva.com/7983/443971-7983627.pdf?src-supplier=Element14; ComponentLink3Description: https://datasheet.ciiva.com/7983/443971-7983627.pdf?src-supplier=Element14; ComponentLink4URL: https://datasheet.ciiva.com/22643/1868787-22643388.pdf?src-supplier=Element14; ComponentLink4Description: https://datasheet.ciiva.com/22643/1868787-22643388.pdf?src-supplier=Element14; ComponentLink5URL: https://datasheet.ciiva.com/46382/443971-46382072.pdf?src-supplier=Element14; ComponentLink5Description: https://datasheet.ciiva.com/46382/443971-46382072.pdf?src-supplier=Element14; ComponentLink6URL: https://datasheet.ciiva.com/29721/pyu-r-int-thick-7-29721178.pdf?src-supplier=Digi-Key; ComponentLink6Description: https://datasheet.ciiva.com/29721/pyu-r-int-thick-7-29721178.pdf?src-supplier=Digi-Key; ComponentLink7URL: https://datasheet.ciiva.com/29721/pyu-rc0603-51-rohs-l-4-29721179.pdf?src-supplier=Digi-Key; ComponentLink7Description: https://datasheet.ciiva.com/29721/pyu-rc0603-51-rohs-l-4-29721179.pdf?src-supplier=Digi-Key; ComponentLink8URL: https://datasheet.ciiva.com/5558/rc0603-272842-5558341.pdf?src-supplier=Mouser; ComponentLink8Description: https://datasheet.ciiva.com/5558/rc0603-272842-5558341.pdf?src-supplier=Mouser; Supplier Part Number 1: 603-RC0603FR-070RL; _Checked_SCH: HoP; _Creator: HoP; _SYM_REF: RES_0R_100mW_1%_0603; Case/Package: 0603; Tolerance: 1%
U?#11 U?#12 = Silabs_CP2104-F03-GMR: MFG: Silicon Labs; _Checked_PCB: N.A; _Checked_SCH: HoP; Supplier: Digikey; Supplier Part Number: 336-4146-6-ND; RoHS: Yes; Category: Interface ICs; Pricing: 1=4.96, 10=3.78, 25=3.484, 100=3.159, 250=3.00408, 500=2.91068 (USD); Height: 800um; ComponentLink1URL: https://datasheet.ciiva.com/14939/cp2104-14939979.pdf?src-supplier=Digikey; ComponentLink1Description: https://datasheet.ciiva.com/14939/cp2104-14939979.pdf?src-supplier=Digikey; ComponentLink2URL: https://datasheet.ciiva.com/15150/getdatasheetpartid-711722-15150533.pdf?src-supplier=Verical; ComponentLink2Description: https://datasheet.ciiva.com/15150/getdatasheetpartid-711722-15150533.pdf?src-supplier=Verical; _Creator: HoP; _SYM_REF: IC_USB-SERIAL_CP2104-F03-GMR_3-5.25Vin_2Mbit_QFN-24; Case/Package: QFN-24